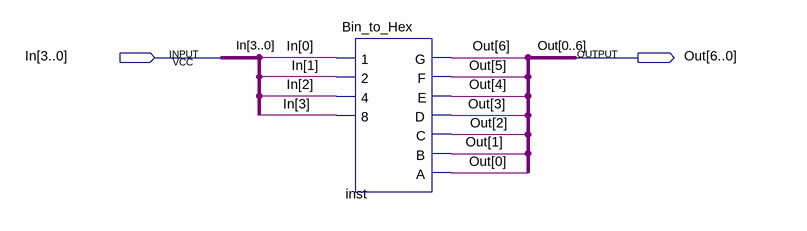
[diagram p0: schematic sheet]
// Quartus schematic Bin_to_Hex_Bus.bdf as structural Verilog: 1 symbols, 2 pins
module Bin_to_Hex_Bus (
  input  [3:0] In,
  output [6:0] Out
);

  Bin_to_Hex inst (
    .\8 (In[3]), .\4 (In[2]), .\2 (In[1]), .\1 (In[0]), .G(Out[6]), .F(Out[5]), .E(Out[4]), .D(Out[3]),
    .C(Out[2]), .B(Out[1]), .A(Out[0]));
endmodule
